# EAGLE design StompBoard (EAGLE 9.5.2)
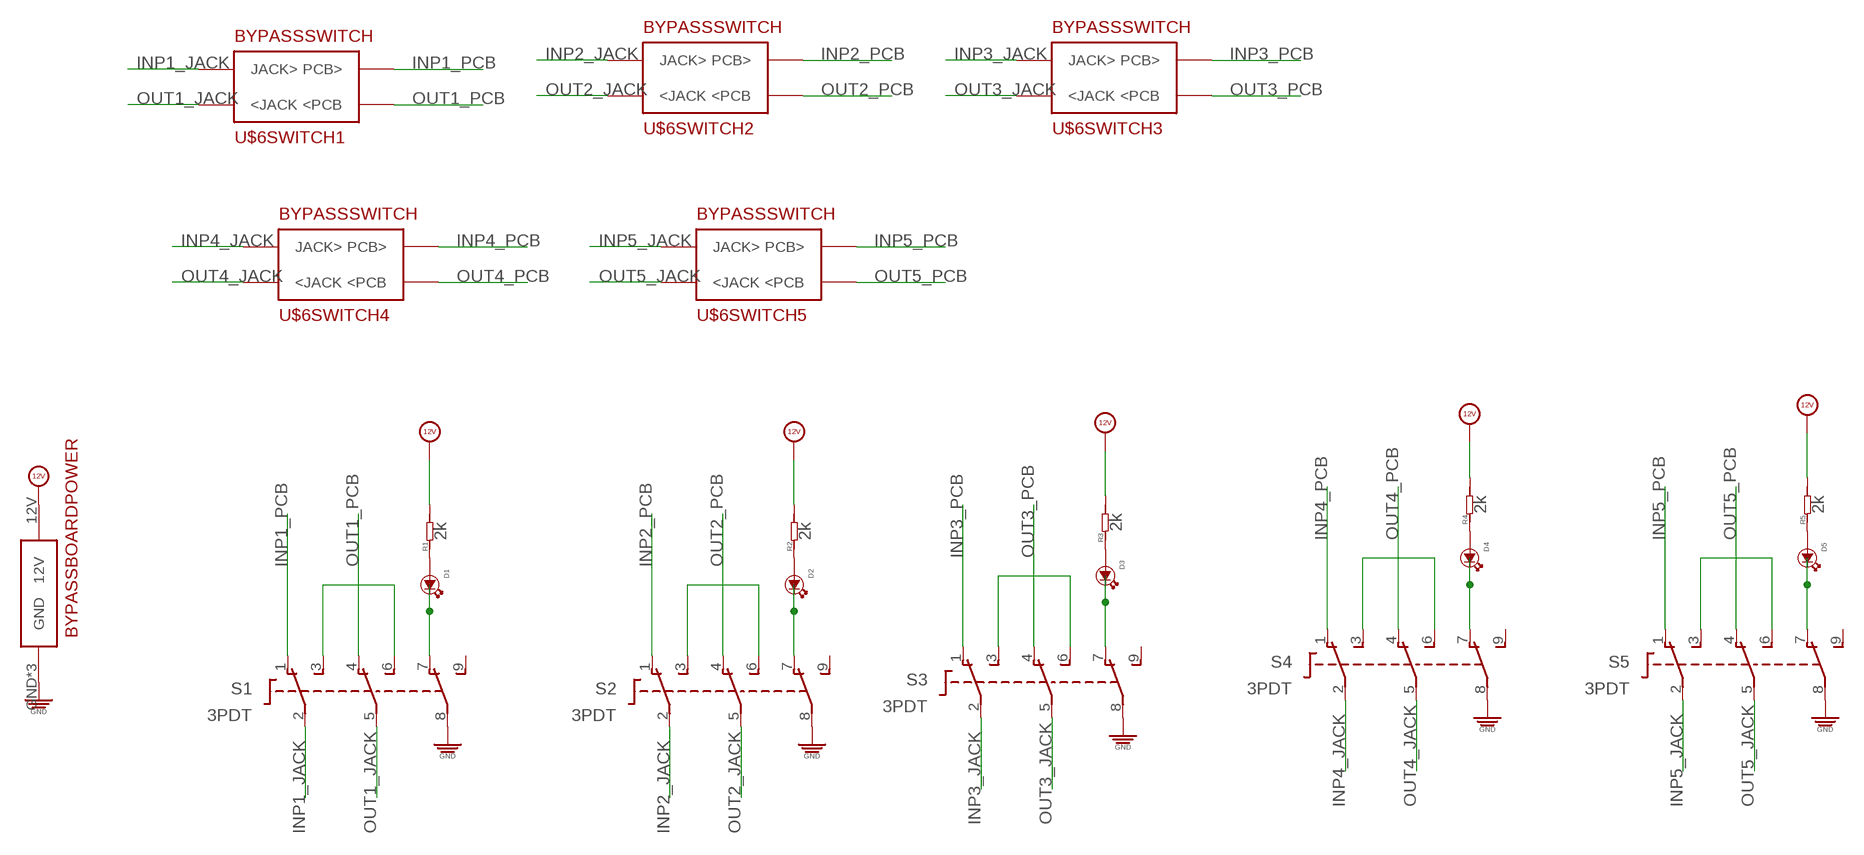
[diagram p0: schematic, sheet 1]

## Parts
D1  LED3MM  [3MMLED]
D2  LED3MM  [3MMLED]
D3  LED3MM  [3MMLED]
D4  LED3MM  [3MMLED]
D5  LED3MM  [3MMLED]
R1  2k  R-0603  [R0603]
R2  2k  R-0603  [R0603]
R3  2k  R-0603  [R0603]
R4  2k  R-0603  [R0603]
R5  2k  R-0603  [R0603]
S1  3PDT  [3PDT]
S2  3PDT  [3PDT]
S3  3PDT  [3PDT]
S4  3PDT  [3PDT]
S5  3PDT  [3PDT]
U$6  5STOMPBOARD  [BYPASSBOARD]

## Nets
12V: R1.2 R2.2 R3.2 R4.2 R5.2 U$6.12V
GND: S1.8(P3) S2.8(P3) S3.8(P3) S4.8(P3) S5.8(P3) U$6.GND U$6.GND2(GND) U$6.GND3(GND)
INP1_JACK: S1.2(P1) U$6.P$3(SWITCH1:JACK>)
INP1_PCB: S1.1(O1) U$6.P$4(SWITCH1:PCB>)
INP2_JACK: S2.2(P1) U$6.P$7(SWITCH2:JACK>)
INP2_PCB: S2.1(O1) U$6.P$8(SWITCH2:PCB>)
INP3_JACK: S3.2(P1) U$6.P$11(SWITCH3:JACK>)
INP3_PCB: S3.1(O1) U$6.P$12(SWITCH3:PCB>)
INP4_JACK: S4.2(P1) U$6.P$15(SWITCH4:JACK>)
INP4_PCB: S4.1(O1) U$6.P$16(SWITCH4:PCB>)
INP5_JACK: S5.2(P1) U$6.P$19(SWITCH5:JACK>)
INP5_PCB: S5.1(O1) U$6.P$20(SWITCH5:PCB>)
N$1: S1.3(S1) S1.6(S2)
N$2: S2.3(S1) S2.6(S2)
N$3: D1.- S1.7(O3)
N$4: D1.+ R1.1
N$5: D2.- S2.7(O3)
N$6: D2.+ R2.1
N$7: S3.3(S1) S3.6(S2)
N$8: D3.- S3.7(O3)
N$9: D3.+ R3.1
N$10: S4.3(S1) S4.6(S2)
N$11: D4.- S4.7(O3)
N$12: D4.+ R4.1
N$13: S5.3(S1) S5.6(S2)
N$14: D5.- S5.7(O3)
N$15: D5.+ R5.1
OUT1_JACK: S1.5(P2) U$6.P$1(SWITCH1:<JACK)
OUT1_PCB: S1.4(O2) U$6.P$2(SWITCH1:<PCB)
OUT2_JACK: S2.5(P2) U$6.P$5(SWITCH2:<JACK)
OUT2_PCB: S2.4(O2) U$6.P$6(SWITCH2:<PCB)
OUT3_JACK: S3.5(P2) U$6.P$9(SWITCH3:<JACK)
OUT3_PCB: S3.4(O2) U$6.P$10(SWITCH3:<PCB)
OUT4_JACK: S4.5(P2) U$6.P$13(SWITCH4:<JACK)
OUT4_PCB: S4.4(O2) U$6.P$14(SWITCH4:<PCB)
OUT5_JACK: S5.5(P2) U$6.P$17(SWITCH5:<JACK)
OUT5_PCB: S5.4(O2) U$6.P$18(SWITCH5:<PCB)
Unconnected: S1.9(S3) S2.9(S3) S3.9(S3) S4.9(S3) S5.9(S3)

## Library data of the parts
D1-D5 = EurorackModularParts:LED*: LED
R1-R5 = OPL:R*
S1-S5 = switch:3PDT: 3PDT 9 pin footswitch SF17020F-0302-21R-L Source: 3PDT.jpg
U$6 = EurorackModularParts:5STOMPBOARD

## Net classes
0 default: width 0.33 mm

## Board
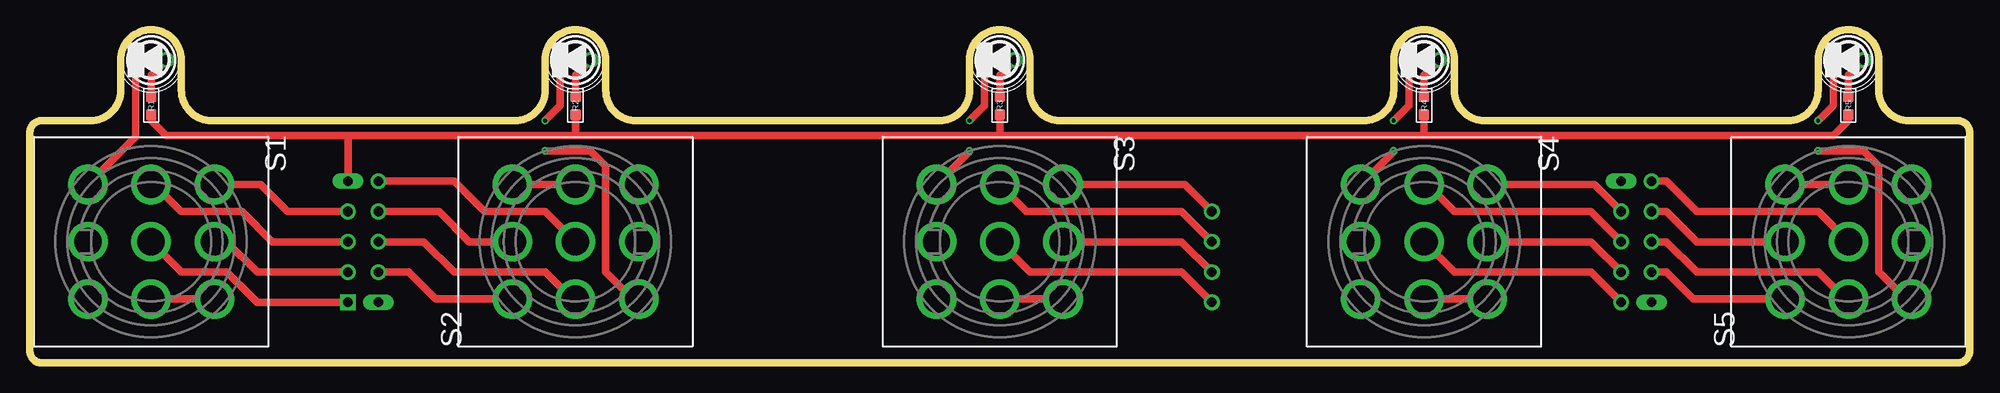
[diagram p1: board, top side]
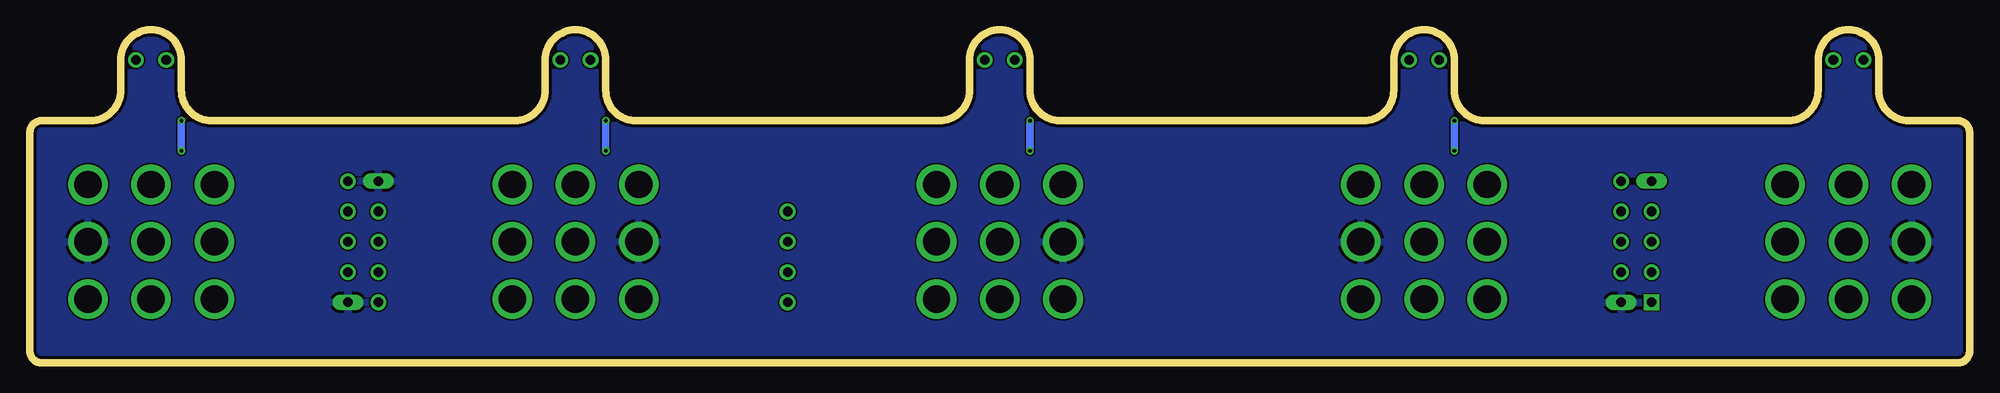
[diagram p2: board, bottom side, seen from below]

Size 162.56 x 27.94 mm. Coordinates in mm from the lower left corner, seen from the top.
Outline: 0,19.32 0,1 arc90 1,0 161.56,0 arc90 162.56,1 162.56,19.32 arc90 161.56,20.32 157.48,20.32 arc-90 154.94,22.86 154.94,25.4 arc90 152.4,27.94 arc90 149.86,25.4 149.86,22.86 arc-90 147.32,20.32 121.92,20.32 arc-90 119.38,22.86 119.38,25.4 arc90 116.84,27.94 arc90 114.3,25.4 114.3,22.86 arc-90 111.76,20.32 86.36,20.32 arc-90 83.82,22.86 83.82,25.4 arc90 81.28,27.94 arc90 78.74,25.4 78.74,22.86 arc-90 76.2,20.32 50.8,20.32 arc-90 48.26,22.86 48.26,25.4 arc90 45.72,27.94 arc90 43.18,25.4 43.18,22.86 arc-90 40.64,20.32 15.24,20.32 arc-90 12.7,22.86 12.7,25.4 arc90 10.16,27.94 arc90 7.62,25.4 7.62,22.86 arc-90 5.08,20.32 1,20.32 arc90 0,19.32
Copper layers (1*16): Top 0.035mm / dielectric 1.5mm / Bottom 0.035mm
Design rules "dirt_cheap_dirty_boards.v1": minimum track width 5mil, minimum drill 12mil, track to track 5mil, track to pad 5mil, pad to pad 5mil, via to via 5mil, smd to smd 0mil, copper to edge 10mil, drill to drill 10mil, minimum pad ring 10mil, minimum via ring 6mil, stop-mask expansion 2mil, vias tented up to drill 25mil, thermal gap 10mil

### Footprints (pad centres in the part's own frame; a part is rotated, then mirrored left to right if it is on the bottom)
3MMLED = drill 0.8: + -1.27,0; - 1.27,0
R0603 = smd 0.889 x 0.889: 1 -0.762,0; 2 0.762,0
3PDT = drill 2.3 pad 3.1: 1 -4.8,5.3; 2 0,5.3; 3 4.8,5.3; 4 -4.8,0; 5 0,0; 6 4.8,0; 7 -4.8,-5.3; 8 0,-5.3; 9 4.8,-5.3
BYPASSBOARD = drill 0.8 long: 12V 31.75,15.24; GND 34.29,5.08; GND2 138.43,15.24; GND3 140.97,5.08 | drill 0.8 square: P$1 31.75,5.08 | drill 0.8: P$2 31.75,10.16; P$3 31.75,7.62; P$4 31.75,12.7; P$5 34.29,15.24; P$6 34.29,10.16; P$7 34.29,12.7; P$8 34.29,7.62; P$9 104.14,5.08; P$10 104.14,10.16; P$11 104.14,7.62; P$12 104.14,12.7; P$13 138.43,5.08; P$14 138.43,10.16; P$15 138.43,7.62; P$16 138.43,12.7; P$17 140.97,15.24; P$18 140.97,10.16; P$19 140.97,12.7; P$20 140.97,7.62

### Placement (x,y rotation side)
D1  10.16,25.4 180 top
D2  45.72,25.4 180 top
D3  81.28,25.4 180 top
D4  116.84,25.4 180 top
D5  152.4,25.4 180 top
R1  10.16,21.59 270 top
R2  45.72,21.59 270 top
R3  81.28,21.59 270 top
R4  116.84,21.59 270 top
R5  152.4,21.59 270 top
S1  10.16,10.16 270 top
S2  45.72,10.16 90 top
S3  81.28,10.16 270 top
S4  116.84,10.16 270 top
S5  152.4,10.16 90 top
U$6  -5.08,0 0 top

### Tracks (layer width: path | path; a pad name or v marks a point on that pad's centre or on a via)
12V
  Top 0.61: R1.2 10.16,20.32 11.43,19.05 26.67,19.05 | U$6.12V 26.67,19.05 | 26.67,19.05 45.72,19.05 | 45.72,19.05 81.28,19.05 | R3.2 81.28,19.05 | 81.28,19.05 116.84,19.05 | 116.84,19.05 R4.2 | 116.84,19.05 151.13,19.05 152.4,20.32 R5.2 | R2.2 45.72,19.05
GND
  pour Bottom: -1.27,31.75 166.37,31.75 166.37,-3.81 -2.54,-3.81 -2.54,31.75
INP1_JACK
  Top 0.61: S1.2 16.51,10.16 19.05,7.62 U$6.P$3
INP1_PCB
  Top 0.61: U$6.P$4 21.59,12.7 19.33,14.96 S1.1
INP2_JACK
  Top 0.61: S2.2 36.83,10.16 34.29,12.7 U$6.P$7
INP2_PCB
  Top 0.61: U$6.P$8 31.75,7.62 34.01,5.36 S2.1
INP3_JACK
  Top 0.61: S3.2 96.52,10.16 U$6.P$11
INP3_PCB
  Top 0.61: U$6.P$12 96.8,14.96 S3.1
INP4_JACK
  Top 0.61: S4.2 130.81,10.16 U$6.P$15
INP4_PCB
  Top 0.61: S4.1 131.09,14.96 U$6.P$16
INP5_JACK
  Top 0.61: S5.2 139.7,10.16 137.16,12.7 U$6.P$19
INP5_PCB
  Top 0.61: U$6.P$20 137.16,7.62 139.42,5.36 S5.1
N$1
  Top 0.61: S1.6 S1.3
N$2
  Top 0.61: S2.6 S2.3
N$3
  Top 0.61: D1.- 8.89,18.99 S1.7
N$4
  Top 0.61: R1.1 10.16,24.13 D1.+
N$5  (via drill 0.3)
  Top 0.61: S2.7 50.52,5.36 48.26,7.62 48.26,16.51 46.99,17.78 v43.18,17.78 | v43.18,20.32 44.45,21.59 D2.-
  Bottom 0.61: v43.18,17.78 v43.18,20.32
N$6
  Top 0.61: R2.1 45.72,24.13 D2.+
N$7
  Top 0.61: S3.6 S3.3
N$8  (via drill 0.3)
  Top 0.61: D3.- 80.01,21.59 v78.74,20.32 | v78.74,17.78 78.74,17.72 S3.7
  Bottom 0.61: v78.74,20.32 v78.74,17.78
N$9
  Top 0.61: R3.1 81.28,24.13 D3.+
N$10
  Top 0.61: S4.6 S4.3
N$11  (via drill 0.3)
  Top 0.61: D4.- 115.57,21.59 v114.3,20.32 | v114.3,17.78 114.3,17.72 S4.7
  Bottom 0.61: v114.3,20.32 v114.3,17.78
N$12
  Top 0.61: R4.1 116.84,24.13 D4.+
N$13
  Top 0.61: S5.6 S5.3
N$14  (via drill 0.3)
  Top 0.61: S5.7 157.2,5.36 154.94,7.62 154.94,16.51 153.67,17.78 v149.86,17.78 | v149.86,20.32 151.13,21.59 D5.-
  Bottom 0.61: v149.86,17.78 v149.86,20.32
N$15
  Top 0.61: R5.1 152.4,24.13 D5.+
OUT1_JACK
  Top 0.61: S1.5 12.7,7.62 16.51,7.62 19.05,5.08 U$6.P$1
OUT1_PCB
  Top 0.61: S1.4 10.16,15.24 12.7,12.7 17.78,12.7 20.32,10.16 U$6.P$2
OUT2_JACK
  Top 0.61: S2.5 43.18,12.7 38.1,12.7 35.56,15.24 U$6.P$5
OUT2_PCB
  Top 0.61: S2.4 45.72,5.08 43.18,7.62 35.56,7.62 33.02,10.16 U$6.P$6
OUT3_JACK
  Top 0.61: S3.5 83.82,7.62 96.52,7.62 U$6.P$9
OUT3_PCB
  Top 0.61: U$6.P$10 96.52,12.7 83.54,12.7 S3.4
OUT4_JACK
  Top 0.61: S4.5 119.38,7.62 130.81,7.62 U$6.P$13
OUT4_PCB
  Top 0.61: S4.4 116.84,15.24 119.38,12.7 130.81,12.7 U$6.P$14
OUT5_JACK
  Top 0.61: S5.5 149.86,12.7 139.7,12.7 137.16,15.24 U$6.P$17
OUT5_PCB
  Top 0.61: S5.4 152.4,5.08 149.86,7.62 139.7,7.62 137.16,10.16 U$6.P$18